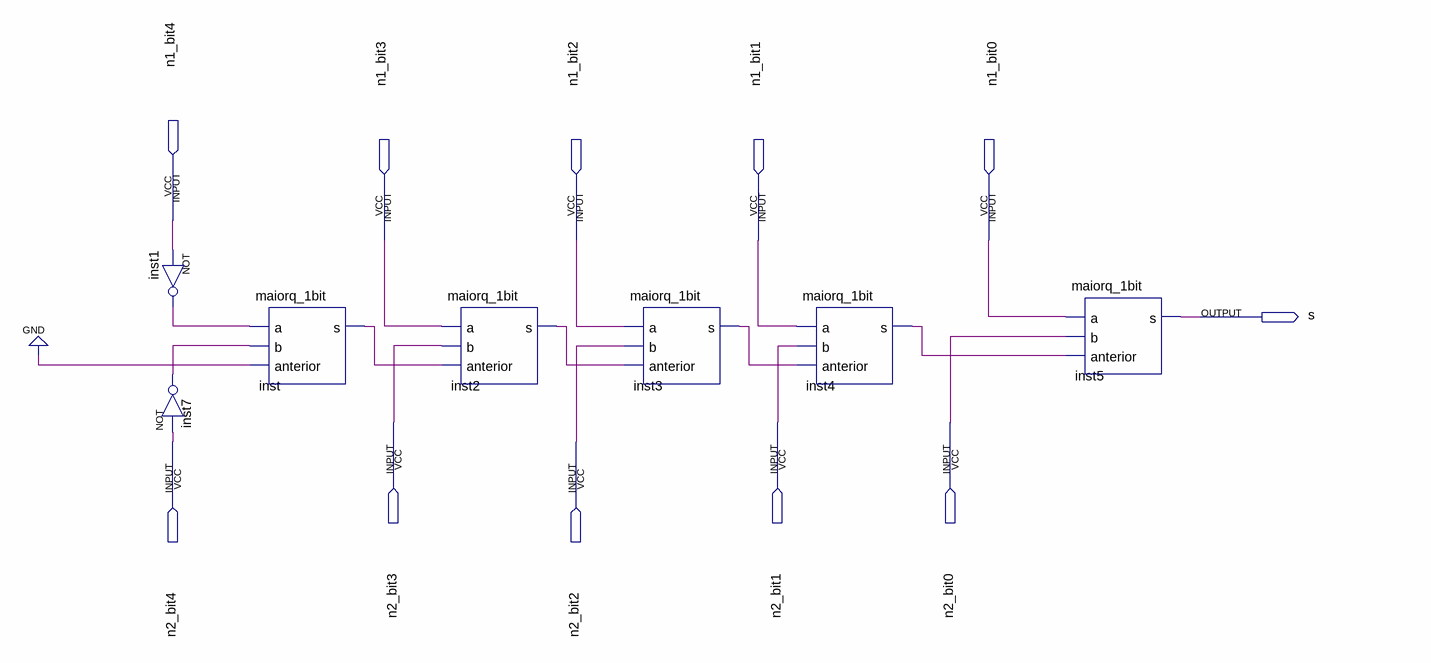
[diagram p0: schematic sheet]
// Quartus schematic maiorq_5bits.bdf as structural Verilog: 7 symbols, 11 pins
module maiorq_5bits (
  input  n1_bit4,
  input  n1_bit3,
  input  n1_bit2,
  input  n1_bit1,
  input  n1_bit0,
  input  n2_bit3,
  input  n2_bit1,
  input  n2_bit0,
  input  n2_bit4,
  input  n2_bit2,
  output s
);

  wire inst1_out, inst2_s, inst3_s, inst4_s, inst7_out, inst_s;

  not inst1 (inst1_out, n1_bit4);
  not inst7 (inst7_out, n2_bit4);
  maiorq_1bit inst (.a(inst1_out), .b(inst7_out), .anterior(1'b0), .s(inst_s));
  maiorq_1bit inst2 (.a(n1_bit3), .b(n2_bit3), .anterior(inst_s), .s(inst2_s));
  maiorq_1bit inst3 (.a(n1_bit2), .b(n2_bit2), .anterior(inst2_s), .s(inst3_s));
  maiorq_1bit inst4 (.a(n1_bit1), .b(n2_bit1), .anterior(inst3_s), .s(inst4_s));
  maiorq_1bit inst5 (.a(n1_bit0), .b(n2_bit0), .anterior(inst4_s), .s(s));
endmodule
